# EasyEDA schematic schematic.json
TITLE: Sheet_1; REV: 1.0; Date: 2025-02-23; Sheet: 1/1; Drawn By: ptashek; Company: Your Company
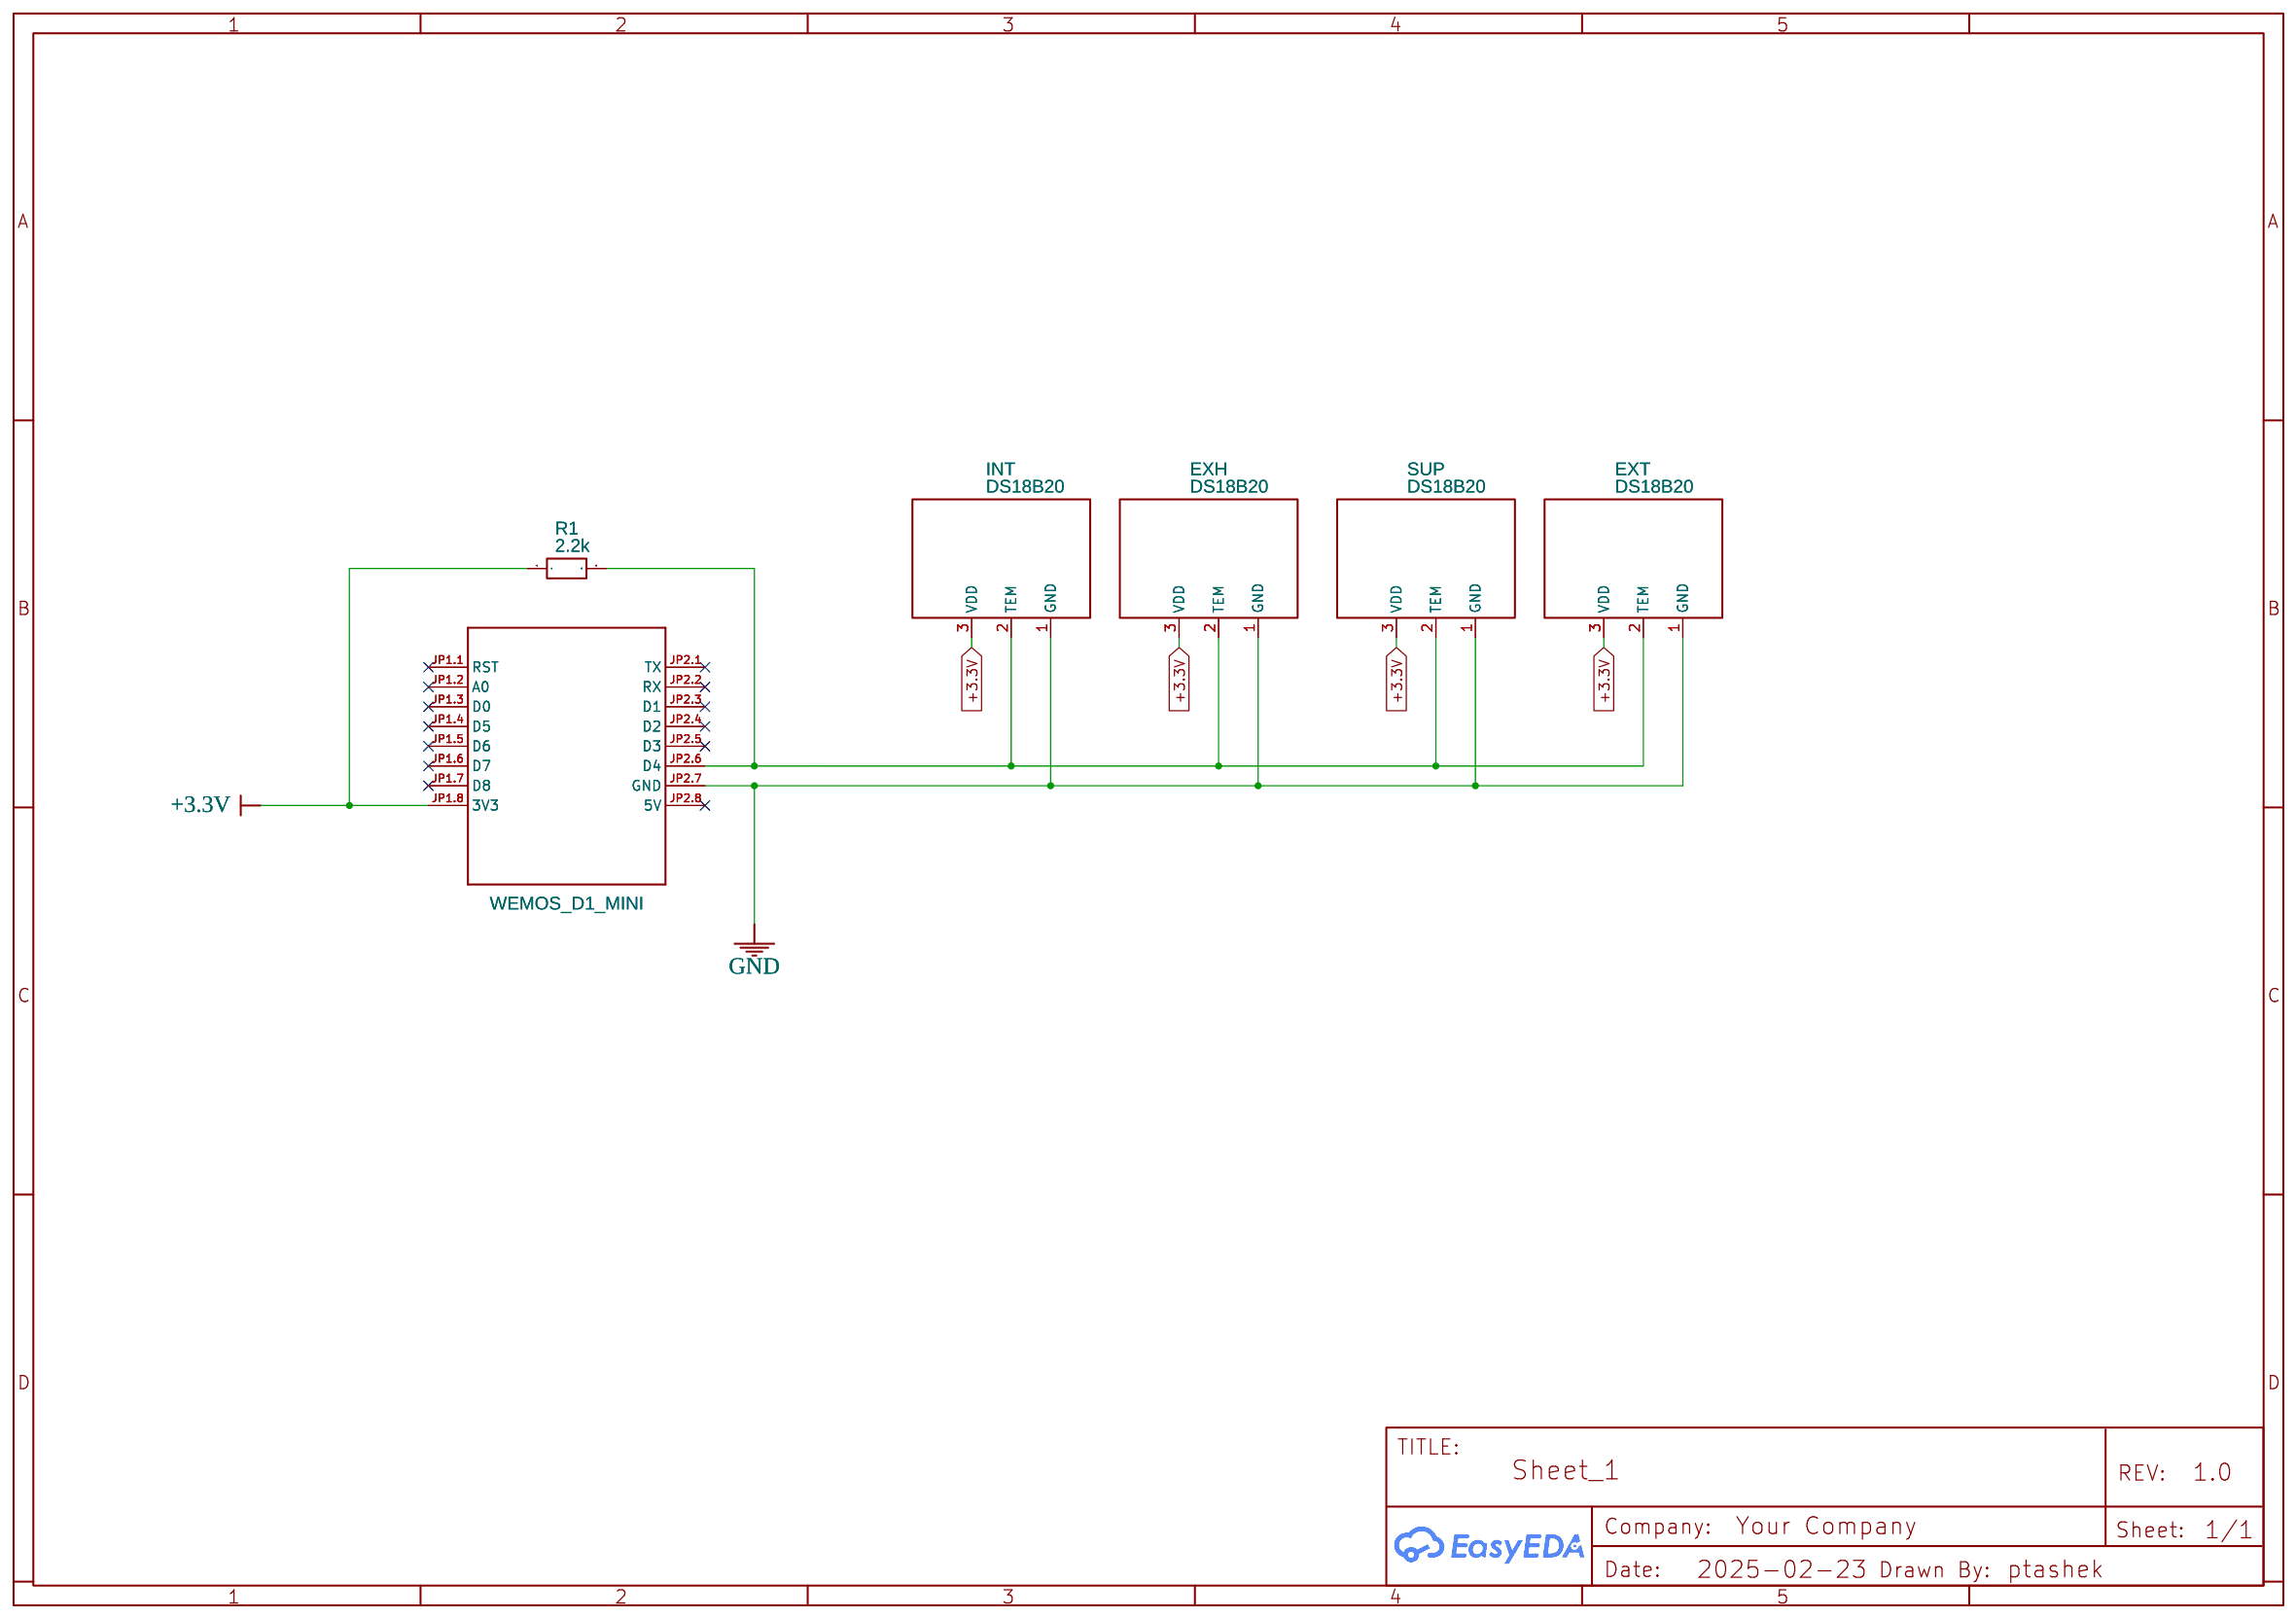
[diagram p0: schematic sheet]

## Parts
EXH  DS18B20  [DS18B20]
EXT  DS18B20  [DS18B20]
INT  DS18B20  [DS18B20]
R1  2.2k  [R2512]
SUP  DS18B20  [DS18B20]
WEMOS_D1_MINI  WEMOS-D1-MINI-SHIELD  [WEMOS-D1-MINI-SHIELD]

## Library data of the parts
EXH EXT INT SUP = DS18B21: Contributor: aslatech
R1 = CR2512F2K20E04Z: Contributor: LCSC; Supplier: LCSC; Supplier Part: C429129; Manufacturer: EVER OHMS(天二科技); JLCPCB Part Class: Extended Part
WEMOS_D1_MINI = WEMOS-D1-MINI-SHIELD: Contributor: Azias

## Nets
+3.3V: EXH.3(VDD) EXT.3(VDD) INT.3(VDD) R1.1 SUP.3(VDD) WEMOS_D1_MINI.JP1.8(3V3)
GND: EXH.1(GND) EXT.1(GND) INT.1(GND) SUP.1(GND) WEMOS_D1_MINI.JP2.7(GND)
Net-(EXH-2): EXH.2(TEM) EXT.2(TEM) INT.2(TEM) R1.2 SUP.2(TEM) WEMOS_D1_MINI.JP2.6(D4)

Not connected (* = marked no-connect by the designer): WEMOS_D1_MINI JP1.1(RST)* JP1.2(A0)* JP1.3(D0)* JP1.4(D5)* JP1.5(D6)* JP1.6(D7)* JP1.7(D8)* JP2.1(TX)* JP2.2(RX)* JP2.3(D1)* JP2.4(D2)* JP2.5(D3)* JP2.8(5V)*
